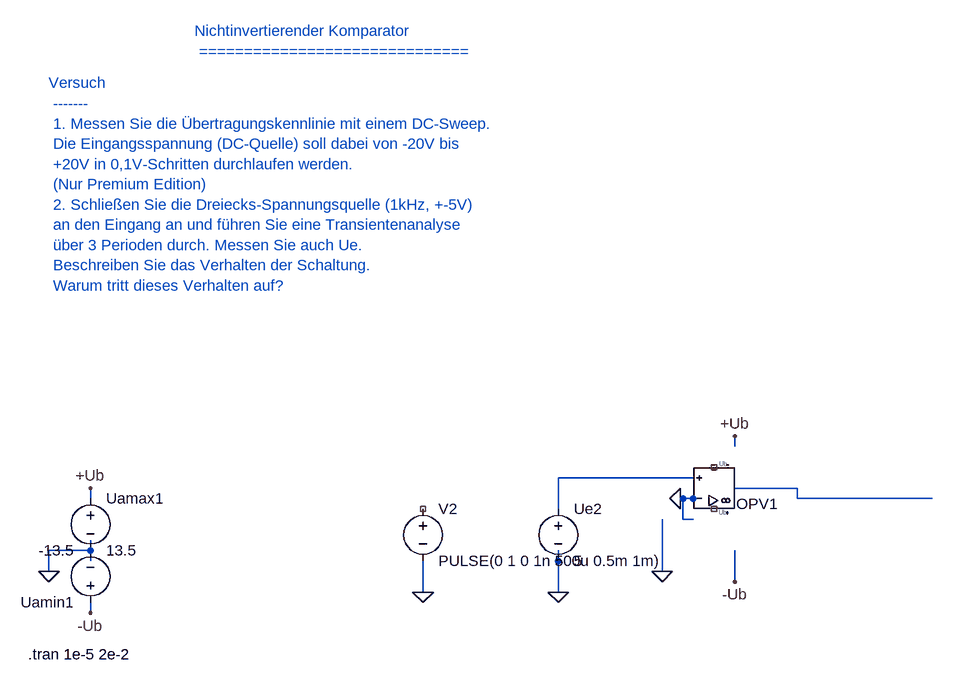
[diagram p0: schematic 1_1_1_Nichtinvertierender_Komparator.asc]
1_1_1_Nichtinvertierender_Komparator.asc, the LTspice schematic file:
Version 4
SHEET 1 880 680
WIRE 1088 800 1072 800
WIRE 1072 800 1072 832
WIRE 1072 832 1088 832
WIRE 1152 784 1248 784
WIRE 1248 784 1248 800
WIRE 160 880 160 864
WIRE 160 880 160 896
WIRE 880 896 880 880
WIRE 672 896 672 912
WIRE 160 800 160 784
WIRE 1152 704 1152 720
WIRE 1152 928 1152 880
WIRE 1456 800 1248 800
WIRE 880 880 880 944
WIRE 1040 912 1040 832
WIRE 160 880 96 880
WIRE 96 880 96 912
WIRE 160 960 160 976
WIRE 672 944 672 912
WIRE 880 816 880 768
WIRE 880 768 1088 768
WIRE 1088 800 1068 800
FLAG 880 944 0
FLAG 96 912 0
FLAG 672 944 0
FLAG 1040 912 0
FLAG 96 912 0
FLAG 880 944 0
FLAG 672 944 0
FLAG 1040 912 0
FLAG 1068 800 0
FLAG 160 784 +Ub
FLAG 1152 704 +Ub
FLAG 160 976 -Ub
FLAG 1152 928 -Ub
SYMBOL UniversalOpAmp2 1120 784 M180
SYMATTR InstName OPV1
SYMATTR Value UniversalOpAmp2
SYMBOL voltage 160 784 R0
SYMATTR InstName Uamax1
SYMATTR Value 13.5
SYMBOL voltage 160 976 R180
SYMATTR InstName Uamin1
SYMATTR Value -13.5
SYMBOL voltage 880 800 R0
SYMATTR InstName Ue2
SYMATTR Value 5
SYMBOL voltage 672 800 R0
SYMATTR InstName V2
SYMATTR Value PULSE(0 1 0 1n 500u 0.5m 1m)
TEXT 64 1040 Left 2 !.tran 1e-5 2e-2
TEXT 320 80 Left 2 ;Nichtinvertierender Komparator \n ==============================
TEXT 96 160 Left 2 ;Versuch \n ------- \n 1. Messen Sie die Übertragungskennlinie mit einem DC-Sweep. \n Die Eingangsspannung (DC-Quelle) soll dabei von -20V bis \n +20V in 0,1V-Schritten durchlaufen werden. \n (Nur Premium Edition) \n 2. Schließen Sie die Dreiecks-Spannungsquelle (1kHz, +-5V) \n an den Eingang an und führen Sie eine Transientenanalyse \n über 3 Perioden durch. Messen Sie auch Ue. \n Beschreiben Sie das Verhalten der Schaltung. \n Warum tritt dieses Verhalten auf?

The netlist it stands for:
* 1_1_1_Nichtinvertierender_Komparator.asc
XOPV1 N002 0 NC_01 NC_02 N001 level2 UniversalOpAmp2 Avol=1Meg GBW=10Meg Slew=10Meg Ilimit=25m Rail=0 Vos=0 En=0 Enk=0 In=0 Ink=0 Rin=500Meg  ; pins In+ In- V+ V- OUT
V§Uamax1 +Ub 0 13.5
V§Uamin1 -Ub 0 -13.5
V§Ue2 N002 0 5
V2 NC_03 0 PULSE(0 1 0 1n 500u 0.5m 1m)
.tran 1e-5 2e-2
* Nichtinvertierender Komparator
*  ==============================
* Versuch
*  -------
*  1. Messen Sie die Übertragungskennlinie mit einem DC-Sweep.
*  Die Eingangsspannung (DC-Quelle) soll dabei von -20V bis
*  +20V in 0,1V-Schritten durchlaufen werden.
*  (Nur Premium Edition)
*  2. Schließen Sie die Dreiecks-Spannungsquelle (1kHz, +-5V)
*  an den Eingang an und führen Sie eine Transientenanalyse
*  über 3 Perioden durch. Messen Sie auch Ue.
*  Beschreiben Sie das Verhalten der Schaltung.
*  Warum tritt dieses Verhalten auf?
.lib UniversalOpAmp2.lib
.backanno
.end